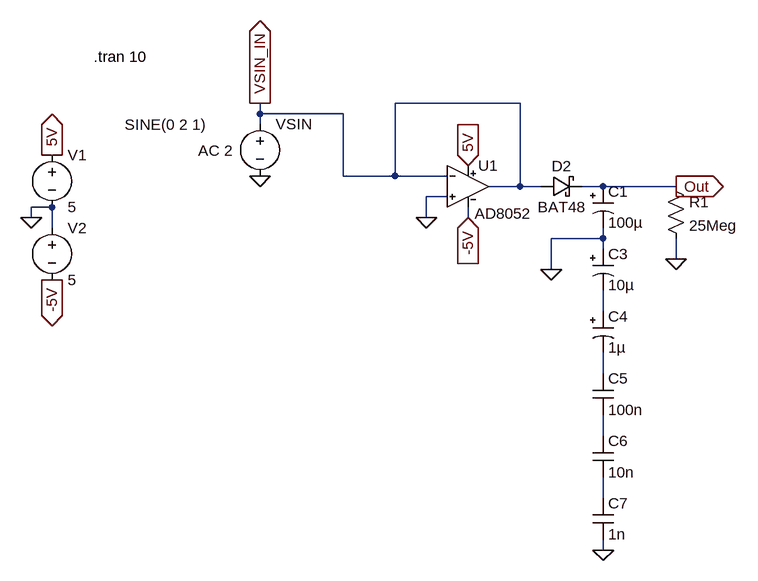
[diagram p0: schematic lf_wobbulator_100uf.asc]
lf_wobbulator_100uf.asc, the LTspice schematic file:
Version 4
SHEET 1 1728 740
WIRE 528 32 336 32
WIRE 128 48 128 32
WIRE 256 48 128 48
WIRE 128 64 128 48
WIRE 256 144 256 48
WIRE 336 144 336 32
WIRE 336 144 256 144
WIRE 416 144 336 144
WIRE 528 160 528 32
WIRE 528 160 480 160
WIRE 560 160 528 160
WIRE 656 160 624 160
WIRE 768 160 656 160
WIRE 416 176 384 176
WIRE -192 192 -224 192
WIRE -224 208 -224 192
WIRE 384 208 384 176
WIRE 448 208 448 192
WIRE -192 224 -192 192
WIRE 656 240 656 224
WIRE 656 240 576 240
WIRE 656 256 656 240
WIRE 768 272 768 240
WIRE 576 288 576 240
WIRE 656 352 656 320
WIRE 656 448 656 416
WIRE 656 544 656 512
WIRE 656 640 656 608
WIRE 656 720 656 704
FLAG 128 144 0
FLAG 128 32 VSIN_IN
IOPIN 128 32 Out
FLAG 448 128 5V
IOPIN 448 128 In
FLAG 768 272 0
FLAG -192 304 -5V
IOPIN -192 304 Out
FLAG 448 208 -5V
IOPIN 448 208 In
FLAG 384 208 0
FLAG -192 112 5V
IOPIN -192 112 Out
FLAG -224 208 0
FLAG 768 160 Out
IOPIN 768 160 Out
FLAG 656 720 0
FLAG 576 288 0
SYMBOL voltage 128 48 R0
WINDOW 123 -95 57 Left 2
WINDOW 39 0 0 Left 0
WINDOW 3 -208 17 Left 2
SYMATTR Value2 AC 2
SYMATTR Value SINE(0 2 1)
SYMATTR InstName VSIN
SYMBOL res 752 144 R0
SYMATTR InstName R1
SYMATTR Value 25Meg
SYMBOL voltage -192 96 R0
WINDOW 123 0 0 Left 0
WINDOW 39 0 0 Left 0
SYMATTR InstName V1
SYMATTR Value 5
SYMBOL voltage -192 208 R0
WINDOW 123 0 0 Left 0
WINDOW 39 0 0 Left 0
SYMATTR InstName V2
SYMATTR Value 5
SYMBOL OpAmps\\AD8052 448 160 R0
WINDOW 3 54 26 Top 2
SYMATTR InstName U1
SYMBOL polcap 640 160 R0
SYMATTR InstName C1
SYMATTR Value 100µ
SYMATTR Description Capacitor
SYMATTR Type cap
SYMATTR SpiceLine V=10 Irms=17m Rser=1.9384 Lser=846.868p mfg="Würth Elektronik" pn="865250240001 WCAP-ASNP 4x5,5" type="Al electrolytic"
SYMBOL schottky 560 176 R270
WINDOW 0 32 32 VTop 2
WINDOW 3 0 32 VBottom 2
SYMATTR InstName D2
SYMATTR Value BAT48
SYMATTR Description Diode
SYMATTR Type diode
SYMBOL polcap 640 256 R0
SYMATTR InstName C3
SYMATTR Value 10µ
SYMATTR Description Capacitor
SYMATTR Type cap
SYMATTR SpiceLine V=10 Irms=17m Rser=1.9384 Lser=846.868p mfg="Würth Elektronik" pn="865250240001 WCAP-ASNP 4x5,5" type="Al electrolytic"
SYMBOL polcap 640 352 R0
SYMATTR InstName C4
SYMATTR Value 1µ
SYMATTR Description Capacitor
SYMATTR Type cap
SYMATTR SpiceLine V=10 Irms=17m Rser=1.9384 Lser=846.868p mfg="Würth Elektronik" pn="865250240001 WCAP-ASNP 4x5,5" type="Al electrolytic"
SYMBOL cap 640 448 R0
SYMATTR InstName C5
SYMATTR Value 100n
SYMBOL cap 640 544 R0
SYMATTR InstName C6
SYMATTR Value 10n
SYMBOL cap 640 640 R0
SYMATTR InstName C7
SYMATTR Value 1n
TEXT -128 -40 Left 2 !.tran 10

The netlist it stands for:
* lf_wobbulator_100uf.asc
VSIN VSIN_IN 0 SINE(0 2 1) AC 2
R1 Out 0 25Meg
V1 5V 0 5
V2 0 -5V 5
XU1 0 VSIN_IN 5V -5V VSIN_IN AD8052  ; pins In+ In- V+ V- OUT
C1 Out 0 100µ V=10 Irms=17m Rser=1.9384 Lser=846.868p mfg="Würth Elektronik" pn="865250240001 WCAP-ASNP 4x5,5" type="Al electrolytic"
D2 VSIN_IN Out BAT48
C3 0 N001 10µ V=10 Irms=17m Rser=1.9384 Lser=846.868p mfg="Würth Elektronik" pn="865250240001 WCAP-ASNP 4x5,5" type="Al electrolytic"
C4 N001 N002 1µ V=10 Irms=17m Rser=1.9384 Lser=846.868p mfg="Würth Elektronik" pn="865250240001 WCAP-ASNP 4x5,5" type="Al electrolytic"
C5 N002 N003 100n
C6 N003 N004 10n
C7 N004 0 1n
.model D D
.lib standard.dio
.tran 10
.lib AD8052.sub
.backanno
.end